# EAGLE design esquematico (EAGLE 7.6.0)
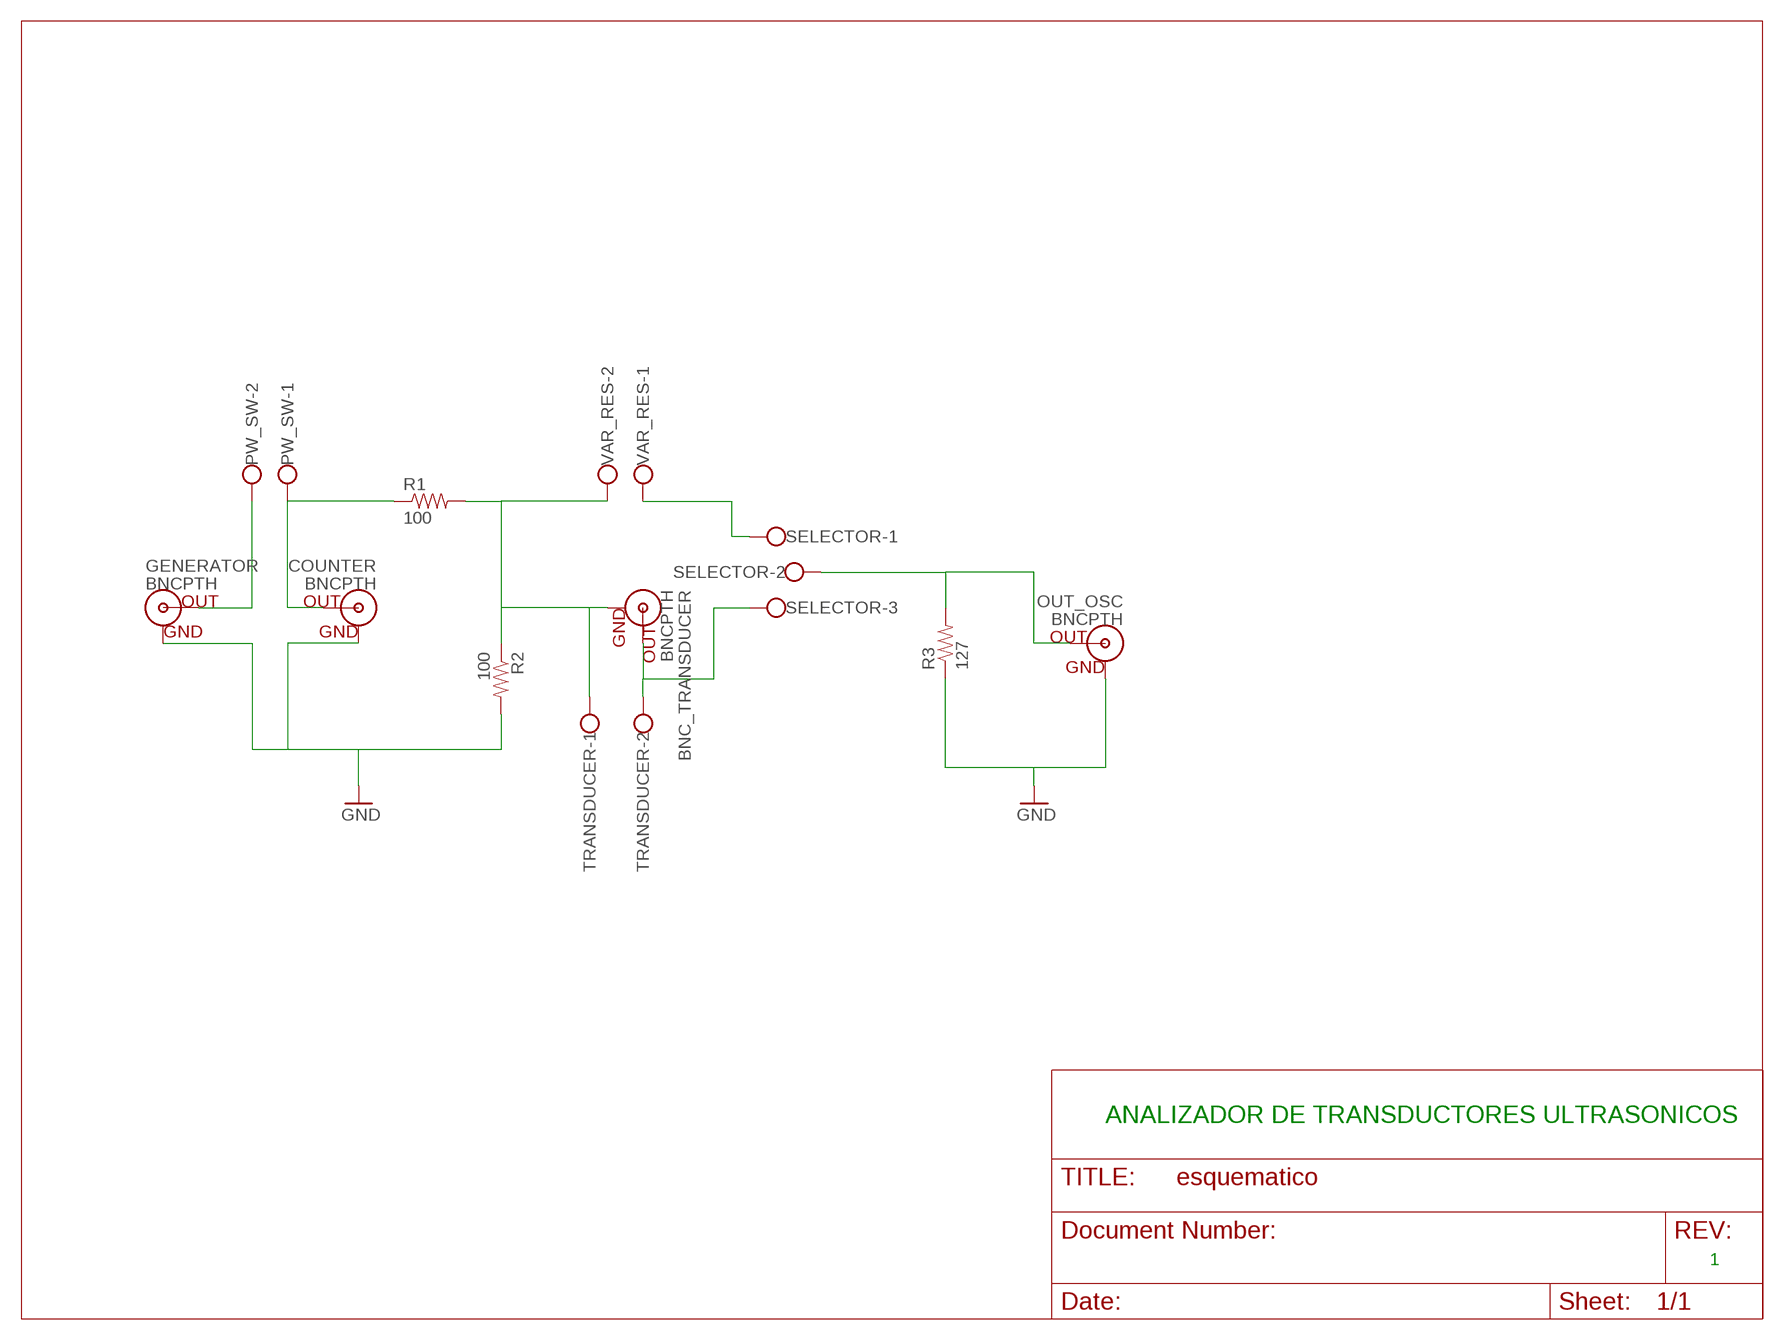
[diagram p0: schematic, sheet 1]

## Parts
BNC_TRANSDUCER  BNCPTH  [BNC]
COUNTER  BNCPTH  [BNC]
GENERATOR  BNCPTH  [BNC]
OUT_OSC  BNCPTH  [BNC]
PW_SW  W237-102  [W237-102]
R1  100  RESISTORPTH-1/4W  [AXIAL-0.4]
R2  100  RESISTORPTH-1/4W  [AXIAL-0.4]
R3  127  RESISTORPTH-1/4W  [AXIAL-0.4]
SELECTOR  W237-103  [W237-103]
TRANSDUCER  W237-102  [W237-102]
VAR_RES  W237-102  [W237-102]

## Nets
GND: COUNTER.GND GENERATOR.GND OUT_OSC.GND R2.P$2 R3.P$1
N$1: BNC_TRANSDUCER.GND R1.P$2 R2.P$1 TRANSDUCER.1 VAR_RES.2
N$2: GENERATOR.S(OUT) PW_SW.2
N$3: COUNTER.S(OUT) PW_SW.1 R1.P$1
N$7: BNC_TRANSDUCER.S(OUT) SELECTOR.3 TRANSDUCER.2
N$8: SELECTOR.1 VAR_RES.1
N$9: OUT_OSC.S(OUT) R3.P$2 SELECTOR.2

## Notes on the sheet
- ANALIZADOR DE TRANSDUCTORES ULTRASONICOS
- 1

## Library data of the parts
BNC_TRANSDUCER COUNTER GENERATOR OUT_OSC = SparkFun-Connectors:BNC: BNC Connector, Mouser Part# 5227161
PW_SW TRANSDUCER VAR_RES = con-wago-500:W237-102: WAGO SCREW CLAMP; MPN: 237-102; OC_FARNELL: unknown; OC_NEWARK: 70K9898
R1-R3 = SparkFun-Passives:RESISTOR: Resistor Basic schematic elements and footprints for 0603, 1206, and PTH resistors.
SELECTOR = con-wago-500:W237-103: WAGO SCREW CLAMP; MPN: 237-103; OC_FARNELL: unknown; OC_NEWARK: 18M7116

## Net classes
0 default: width 0.305 mm, drill 0.508 mm, clearance 0.254 mm

## Board
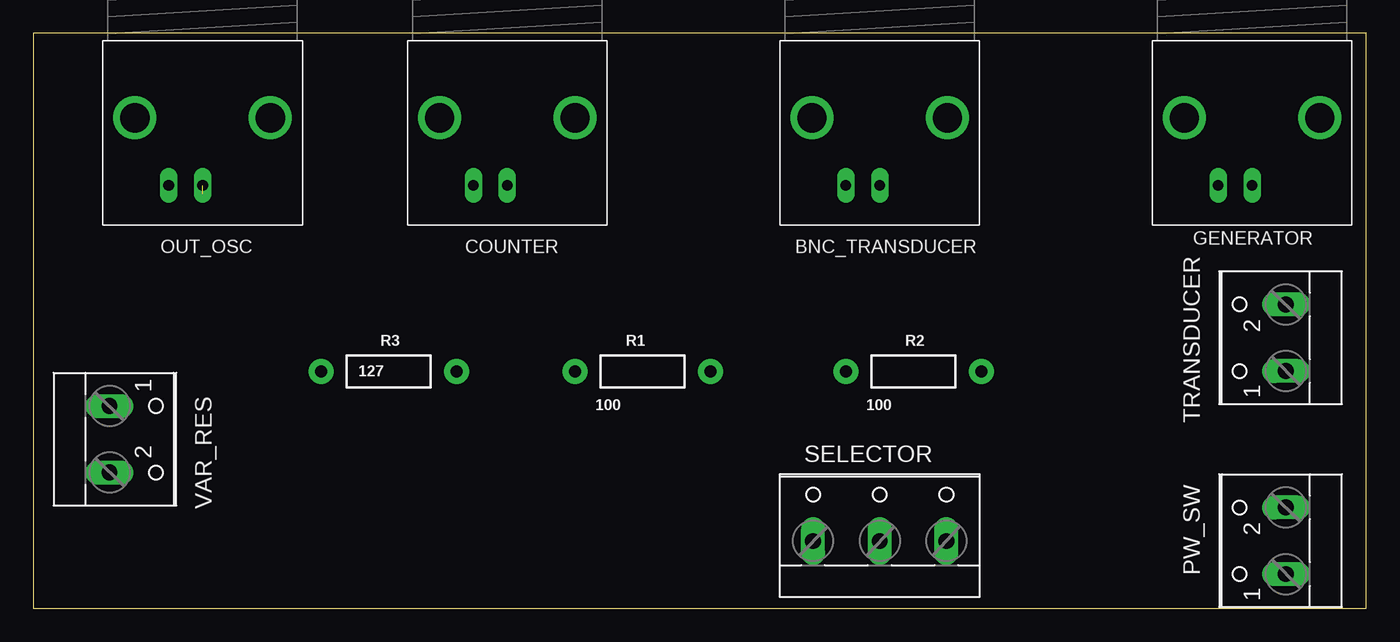
[diagram p1: board, top side]
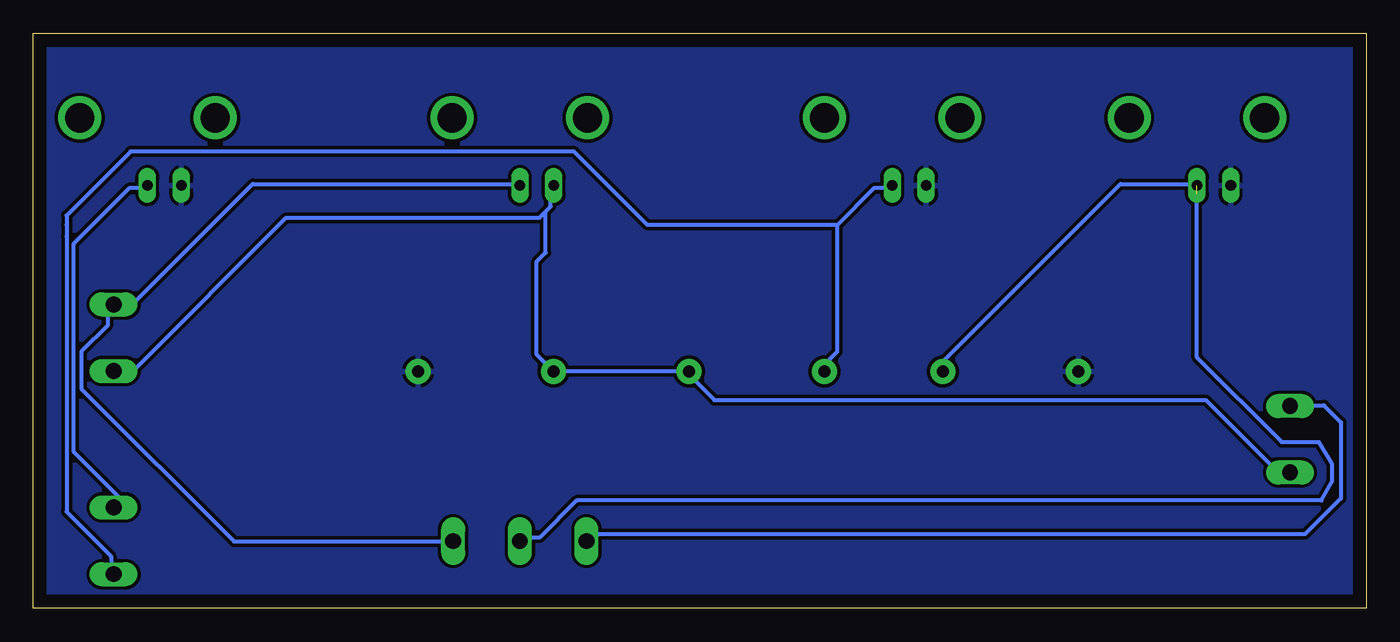
[diagram p2: board, bottom side, seen from below]

Size 100 x 43.17 mm. Coordinates in mm from the lower left corner, seen from the top.
Outline: 0,0 100,0 100,43.17 0,43.17 0,0
Copper layers (1*16): Top 0.035mm / dielectric 1.5mm / Bottom 0.035mm
Design rules "default": minimum track width 10mil, minimum drill 24mil, track to track 8mil, track to pad 8mil, pad to pad 8mil, via to via 8mil, smd to smd 8mil, copper to edge 40mil, drill to drill 8mil, minimum pad ring 10mil, minimum via ring 8mil, stop-mask expansion 4mil, vias tented up to drill 0mil, thermal gap 10mil

### Footprints (pad centres in the part's own frame; a part is rotated, then mirrored left to right if it is on the bottom)
BNC = drill 2.2: 3 -5.08,5.08; 4 5.08,5.08 | drill 0.8 long: GND -2.54,0; S 0,0
W237-102 = drill 1.194 long: 1 -2.5,-1.27; 2 2.5,-1.27
AXIAL-0.4 = drill 0.9 pad 1.88: P$1 -5.08,0; P$2 5.08,0
W237-103 = drill 1.194 long: 1 -5,-1.29; 2 0,-1.29; 3 5,-1.29

### Placement (x,y rotation side)
BNC_TRANSDUCER  63.5,31.75 0 top
COUNTER  35.56,31.75 0 top
GENERATOR  91.44,31.75 0 top
OUT_OSC  12.7,31.75 0 top
PW_SW  92.71,5.08 90 top
R1  45.72,17.78 0 top
R2  66.04,17.78 0 top
R3  26.67,17.78 0 top
SELECTOR  63.5,6.35 0 top
TRANSDUCER  92.71,20.32 90 top
VAR_RES  6.99,12.7 270 top

### Tracks (layer width: path | path; a pad name or v marks a point on that pad's centre or on a via)
GND
  pour Bottom: -5.08,44.45 -6.35,44.45 -6.35,-3.81 104.14,-3.81 105.41,-3.81 105.41,45.72 -5.08,45.72
N$1
  Bottom 0.305: 61.56,29.81 62.03,29.34 81.03,29.34 92.48,17.88 93.88,17.88 TRANSDUCER.1 | 61.56,29.81 61.19,30.18 61.19,31.57 BNC_TRANSDUCER.GND | 50.85,17.6 48.9,15.65 12.01,15.65 6.71,10.34 5.31,10.34 VAR_RES.2 | 50.85,17.6 R1.P$2 | 50.85,17.6 51.03,17.78 R2.P$1 62.23,19.05 62.23,26.04 61.56,26.71 61.56,29.81
N$2
  Bottom 0.305: GENERATOR.S 91.64,31.57 92.76,31.57 96.95,27.38 96.95,11.73 93.6,8.38 93.6,8.1 93.88,7.82 PW_SW.2
N$3
  Bottom 0.305: 39.67,28.78 36.88,31.57 35.76,31.57 COUNTER.S | 39.67,28.78 39.67,19.28 40.51,18.44 40.51,17.88 R1.P$1 | 39.67,28.78 53.92,28.78 59.44,34.29 92.71,34.29 97.51,29.49 97.51,28.78 97.51,27.94 97.51,7.26 94.16,3.91 94.16,2.79 PW_SW.1
N$7
  Bottom 0.305: BNC_TRANSDUCER.S 63.7,31.85 83.54,31.85 92.48,22.91 93.88,22.91 TRANSDUCER.2 94.16,22.63 94.44,22.35 94.44,21.23 96.39,19.28 96.39,16.48 84.94,5.03 68.73,5.03 SELECTOR.3
N$8
  Bottom 0.305: SELECTOR.1 58.4,5.31 58.12,5.59 4.57,5.59 1.91,8.26 1.91,13.97 3.17,15.24 5.67,15.24 VAR_RES.1
N$9  (1 unrouted)
  Bottom 0.305: OUT_OSC.S 12.85,31.85 18.44,31.85 31.57,18.72 31.57,17.88 R3.P$2 | SELECTOR.2 63.42,5.31 62.03,5.31 59.23,8.1 3.35,8.1 2.59,9.5 2.59,10.9 3.56,12.5 6.35,12.5 12.7,18.85 12.7,31.11